# Altium schematic sheet Power.SchDoc: Power Selection
size A4; Revision: AA; SheetNumber: 4; SheetTotal: 6
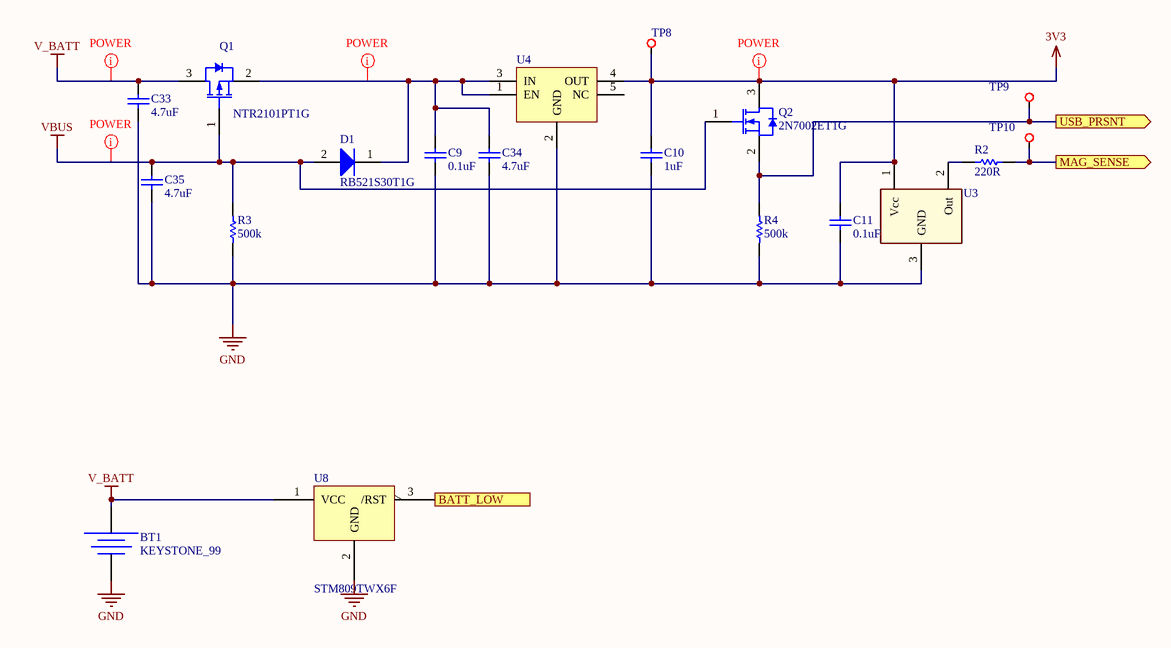
[diagram p0: Power.SchDoc]

## Parts
BT1  KEYSTONE_99  [KEYSTONE_99]
C9  value 0.1uF  [0402cap]  (hidden comment: C0402)
C10  value 1uF  [0402cap]  (hidden comment: C0402)
C11  value 0.1uF  [0402cap]  (hidden comment: C0402)
C33  value 4.7uF  [0603CAP]  (hidden comment: C0603)
C34  value 4.7uF  [0603CAP]  (hidden comment: C0603)
C35  value 4.7uF  [0603CAP]  (hidden comment: C0603)
D1  RB521S30T1G  [ONSC-SOD-523-2-502-01_V]
Q1  NTR2101PT1G  [ONSC-SOT-23-3-318-08_V]
Q2  2N7002ET1G  [ONSC-SOT-23-3-318-08_V]
R2  value 220R  [0402RES]  (hidden comment: R0402)
R3  value 500k  [0402RES]  (hidden comment: R0402)
R4  value 500k  [0402RES]  (hidden comment: R0402)
TP8  TESTPOINT  [TP R25]  (value not drawn)  (no BOM)
TP9  TESTPOINT  [TP R25]  (value not drawn)  (no BOM)
TP10  TESTPOINT  [TP R25]  (value not drawn)  (no BOM)
U3  DRV5032FBDBZT  [SOT-23]  (value not drawn)
U4  IC REG LINEAR 3.3V 200MA ESV  [TCR2EE33,LM(CT]  (value not drawn)
U8  STM809TWX6F  [SOT103P237X112-3N]

## Ports
BATT_LOW (out), MAG_SENSE (out), USB_PRSNT (out)

## Nets
3V3: C10.2 C11.2 Q2.3(D) TP8.1 U3.1(Vcc) U4.4(OUT)
GND: BT1.2(NEG) C9.1 C10.1 C11.1 C33.1 C34.1 C35.1 R3.1 R4.1 U3.3(GND) U4.2(GND) U8.2(GND)
V_BATT: BT1.1(POS) C33.2 Q1.3(D) U8.1(VCC)
VBUS: C35.2 D1.2(A) Q1.1(G) Q2.1(G) R3.2
BATT_LOW: U8.3(/RST) ; port BATT_LOW
MAG_SENSE: R2.2 TP10.1 ; port MAG_SENSE
USB_PRSNT: Q2.2(S) R4.2 TP9.1 ; port USB_PRSNT
NetC9_2: C9.2 C34.2 D1.1(K) Q1.2(S) U4.1(EN) U4.3(IN)
NetR2_1: R2.1 U3.2(Out)

Not connected (* = marked no-connect by the designer): U4 5(NC)

## Layout directives
net class POWER: 3V3, NetC9_2, V_BATT, VBUS

## Notes on the sheet
- Title
- Size:
- Date:
- A4
- Number:
- Time:
- Revision:
- Sheet
- of
- Grand Valley State University
- 301 W Fulton St
- Grand Rapids, MI
- 49504
- File:

## Library data of the parts
BT1 = KEYSTONE_99: Manufacturer 1: Keystone Electronics; Manufacturer Part Number 1: 99; Supplier 1: Digikey; Supplier Part Number 1: 36-99-ND
C9 C11 = C0402: 0402 Ceramic Chip Capacitor - Standard; Manufacturer 1: Samsung; Manufacturer Part Number 1: CL05B104KO5NNNC; Supplier 1: Digi-Key; Supplier Part Number 1: 1276-1001-1-ND
C10 = C0402: 0402 Ceramic Chip Capacitor - Standard
C33-C35 = C0603: 0603 Ceramic Chip Capacitor - Standard
D1 = CMP-1051-00018-1: Schottky Barrier Diode, 2-Pin SOD-523, Pb-Free, Tape and Reel; Manufacturer: On Semiconductor; Configuration: Single; IFSM Max (A): 1; Mounting Technology: Surface Mount; ComponentLink1Description: Manufacturer URL; PackageReference: SOD-523-2-502-01; RoHS: TRUE; ComponentLink3Description: Package Specification; ComponentLink2Description: Datasheet; PackageVersion: Rev. E, 09/2010; PartNumber: RB521S30T1G; ComponentLink3URL: http://www.onsemi.com/pub_link/Collateral/502-01.PDF; ComponentLink1URL: http://www.onsemi.com/; PackageDescription: 2-Pin SOD, Body 1.2 x 0.8 mm; DatasheetVersion: Rev. 8; ComponentLink2URL: http://www.onsemi.cn/pub_link/Collateral/RB521S30T1-D.PDF; Packing: Tape and Reel
Q1 = NTR2101PT1G: Small Signal MOSFET, -8 V, -3.7 A, Single P-Channel, 3-Pin SOT-23, Pb-Free, Tape and Reel; Manufacturer 1: On Semiconductor; Channel Polarity: P Channel; Ciss Typ (pF): 1173; Coss Typ (pF): 289; Crss Typ (pF): 218; ID Max (A): 3.7; PD Max (W): 0.96; V(BR)DSS Min (V): 8; VGS(th) Max (V): 1; DatasheetVersion: Rev. 6; PackageVersion: Rev. AP, 11/2009; PackageReference: SOT-23-3-318-08; PackageDescription: 3-Pin Small Outline Transistor, Body 2.92 x 1.3 mm, Pitch 0.95 mm; Configuration: Single; Package Type: SOT-23-3; Packing: Tape and Reel; RoHS: Pb-Free; VGS Max (V): 8; Mounting Technology: Surface Mount; Manufacturer Part Number 1: NTR2101PT1G; ComponentLink1Description: Manufacturer URL; ComponentLink1URL: http://www.onsemi.com/; ComponentLink2Description: Datasheet; ComponentLink2URL: http://www.onsemi.cn/pub_link/Collateral/NTR2101P-D.PDF; ComponentLink3Description: Package Specification; ComponentLink3URL: http://www.onsemi.cn/pub_link/Collateral/318-08.PDF
Q2 = 2N7002ET1G: Small Signal MOSFET, 60 V, 310 mA, Single, N-Channel, 3-Pin SOT-23, Pb-Free, Tape and Reel; Manufacturer: On Semiconductor; Channel Polarity: N Channel; Ciss Typ (pF): 26.7; Coss Typ (pF): 4.6; Crss Typ (pF): 2.9; ID Max (A): 0.31; V(BR)DSS Min (V): 60; VGS Max (V): 20; VGS(th) Max (V): 2.5; DatasheetVersion: Rev. 3; PackageVersion: Rev. AP, 11/2009; PackageReference: SOT-23-3-318-08; PackageDescription: 3-Pin Small Outline Transistor, Body 2.92 x 1.3 mm, Pitch 0.95 mm; Supplier 1: Digi-Key; Supplier Part Number 1: 2N7002ET1GOSTR-ND; Supplier 2: Digi-Key; Supplier Part Number 2: 2N7002ET1GOSCT-ND; Supplier 3: Digi-Key; Supplier Part Number 3: 2N7002ET1GOSDKR-ND; Supplier 4: Farnell; Supplier Part Number 4: 2317895; Supplier 5: Farnell; Supplier Part Number 5: 2317616; Supplier 6: Newark; Supplier Part Number 6: 09R9861; Supplier 7: Newark; Supplier Part Number 7: 50M2216; Supplier 8: Mouser; Supplier Part Number 8: 863-2N7002ET1G; Configuration: Single; Package Type: SOT-23-3; Packing: Tape and Reel; RoHS: Pb-Free; Mounting Technology: Surface Mount; PartNumber: 2N7002ET1G; ComponentLink1Description: Manufacturer URL; ComponentLink1URL: http://www.onsemi.com/; ComponentLink2Description: Datasheet; ComponentLink2URL: http://www.onsemi.com/pub_link/Collateral/2N7002E-D.PDF; ComponentLink3Description: Package Specification; ComponentLink3URL: http://www.onsemi.cn/pub_link/Collateral/318-08.PDF
R2-R4 = R0402: 0402 Chip Resistor - Standard; ComponentLink1URL: *
TP8-TP10 = TP25: 0.025" Round Test Point; Part Number: 1613; Part Name: Testpoint
U3 = DRV5032FBDBZT: Hall Effect Sensor; Manufacturer: *; Manufacturer PN: *; Vendor: *; Vendor PN: *; Price: *
U4 = TCR2EE33,LM(CT: Linear Voltage Regulator IC Positive Fixed 1 Output  200mA ESV; Manufacturer 1: Toshiba Semiconductor and Storage; Manufacturer Part Number 1: TCR2EE33,LM(CT; Supplier 1: Digikey; Supplier Part Number 1: TCR2EE33LM(CTCT-ND; ComponentLink1Description: Datasheet; ComponentLink1URL: https://toshiba.semicon-storage.com/info/docget.jsp?did=13794&prodName=TCR2EF45
U8 = STM809TWX6F: IC MPU RESET CIRC 3.08V SOT23; Manufacturer 1: STMicroelectronics; Manufacturer Part Number 1: STM809TWX6F; Supplier 1: Digi-Key; Supplier Part Number 1: 497-3339-1-ND; ComponentLink1Description: Datasheet; ComponentLink1URL: https://www.st.com/content/ccc/resource/technical/document/datasheet/cd/e2/ab/27/7d/5d/44/41/CD00003591.pdf/files/CD00003591.pdf/jcr:content/translations/en.CD00003591.pdf